# EAGLE design I2CRobot (EAGLE 5.00)
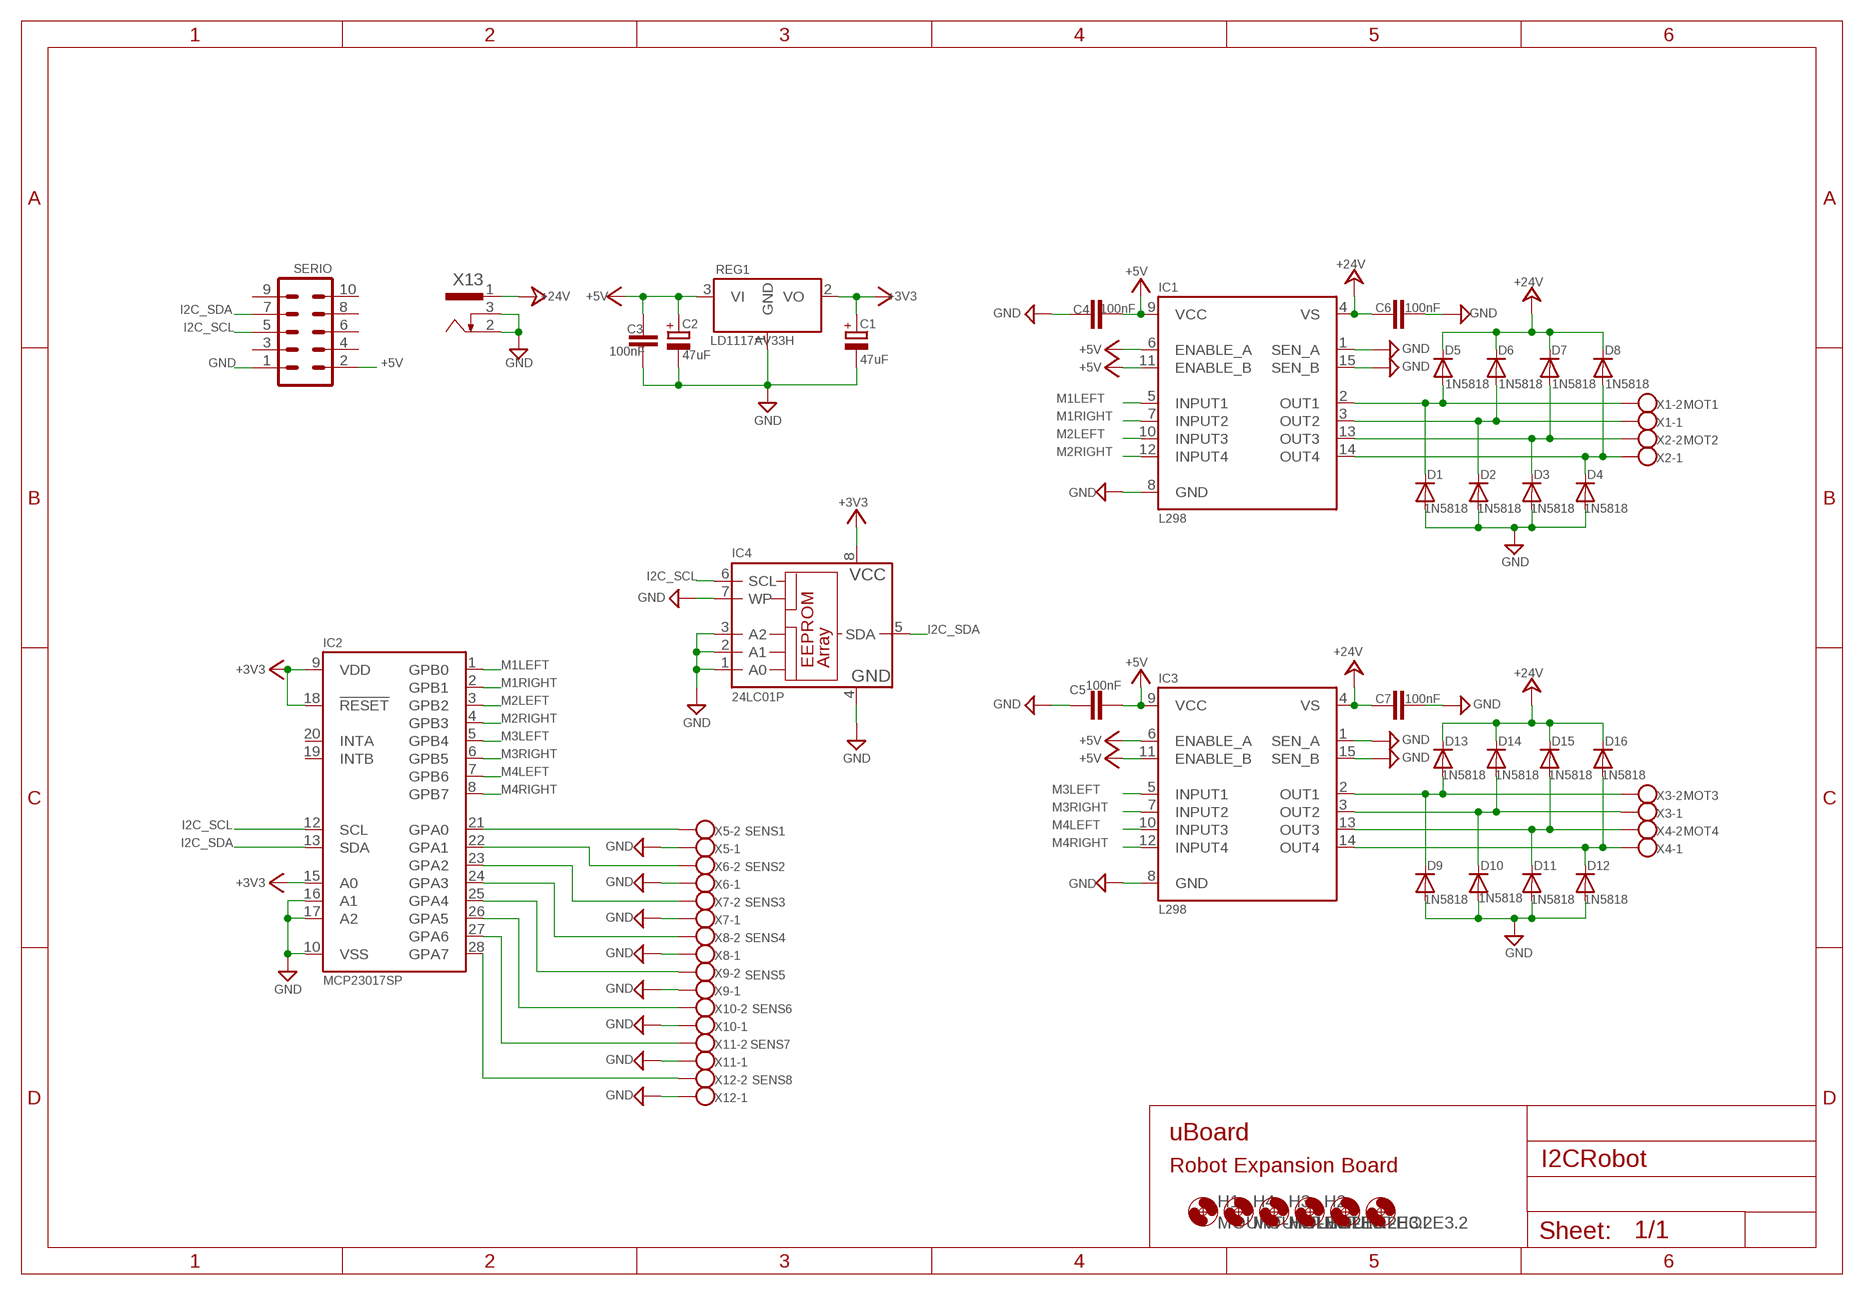
[diagram p0: schematic, sheet 1]

## Parts
C1  47uF  CPOL-EUE2,5-6E  [E2,5-6E]
C2  47uF  CPOL-EUE2,5-6E  [E2,5-6E]
C3  100nF  C-EU025-030X050  [C025-030X050]
C4  100nF  C-EU025-030X050  [C025-030X050]
C5  100nF  C-EU025-030X050  [C025-030X050]
C6  100nF  C-EU025-030X050  [C025-030X050]
C7  100nF  C-EU025-030X050  [C025-030X050]
D1  1N5818  1N4004  [DO41-10]
D2  1N5818  1N4004  [DO41-10]
D3  1N5818  1N4004  [DO41-10]
D4  1N5818  1N4004  [DO41-10]
D5  1N5818  1N4004  [DO41-10]
D6  1N5818  1N4004  [DO41-10]
D7  1N5818  1N4004  [DO41-10]
D8  1N5818  1N4004  [DO41-10]
D9  1N5818  1N4004  [DO41-10]
D10  1N5818  1N4004  [DO41-10]
D11  1N5818  1N4004  [DO41-10]
D12  1N5818  1N4004  [DO41-10]
D13  1N5818  1N4004  [DO41-10]
D14  1N5818  1N4004  [DO41-10]
D15  1N5818  1N4004  [DO41-10]
D16  1N5818  1N4004  [DO41-10]
H1  MOUNT-HOLE3.2  [3,2]
H2  MOUNT-HOLE3.2  [3,2]
H3  MOUNT-HOLE3.2  [3,2]
H4  MOUNT-HOLE3.2  [3,2]
H5  MOUNT-HOLE2.8  [2,8]
H6  MOUNT-HOLE2.8  [2,8]
IC1  L298  [MULTIWATT-15]
IC2  MCP23017SP  [DIL28-3]
IC3  L298  [MULTIWATT-15]
IC4  24LC01P  [DIL8]
REG1  LD1117AV33H  [TO220H]
SERIO  MA05-2  [MA05-2]
X1  MOT1  W237-102  [W237-102]
X2  MOT2  W237-102  [W237-102]
X3  MOT3  W237-102  [W237-102]
X4  MOT4  W237-102  [W237-102]
X5  SENS1  W237-102  [W237-102]
X6  SENS2  W237-102  [W237-102]
X7  SENS3  W237-102  [W237-102]
X8  SENS4  W237-102  [W237-102]
X9  SENS5  W237-102  [W237-102]
X10  SENS6  W237-102  [W237-102]
X11  SENS7  W237-102  [W237-102]
X12  SENS8  W237-102  [W237-102]
X13  733980-62  [733980-62]

## Nets
+3V3: C1.+ IC2.9(VDD) IC2.15(A0) IC2.18(!RESET) IC4.8(VCC) REG1.2(VO)
+5V: C2.+ C3.1 C4.2 C5.2 IC1.6(ENABLE_A) IC1.9(VCC) IC1.11(ENABLE_B) IC3.6(ENABLE_A) IC3.9(VCC) IC3.11(ENABLE_B) REG1.3(VI) SERIO.2
+24V: C6.1 C7.1 D5.C D6.C D7.C D8.C D13.C D14.C D15.C D16.C IC1.4(VS) IC3.4(VS) X13.1
GND: C1.- C2.- C3.2 C4.1 C5.1 C6.2 C7.2 D1.A D2.A D3.A D4.A D9.A D10.A D11.A D12.A IC1.1(SEN_A) IC1.8(GND) IC1.15(SEN_B) IC2.10(VSS) IC2.16(A1) IC2.17(A2) IC3.1(SEN_A) IC3.8(GND) IC3.15(SEN_B) IC4.1(A0) IC4.2(A1) IC4.3(A2) IC4.4(GND) IC4.7(WP) REG1.1(GND) SERIO.1 X5.1 X6.1 X7.1 X8.1 X9.1 X10.1 X11.1 X12.1 X13.2 X13.3
I2C_SCL: IC2.12(SCL) IC4.6(SCL) SERIO.5
I2C_SDA: IC2.13(SDA) IC4.5(SDA) SERIO.7
M1LEFT: IC1.5(INPUT1) IC2.1(GPB0)
M1RIGHT: IC1.7(INPUT2) IC2.2(GPB1)
M2LEFT: IC1.10(INPUT3) IC2.3(GPB2)
M2RIGHT: IC1.12(INPUT4) IC2.4(GPB3)
M3LEFT: IC2.5(GPB4) IC3.5(INPUT1)
M3RIGHT: IC2.6(GPB5) IC3.7(INPUT2)
M4LEFT: IC2.7(GPB6) IC3.10(INPUT3)
M4RIGHT: IC2.8(GPB7) IC3.12(INPUT4)
MOTOR1L: D1.C D5.A IC1.2(OUT1) X1.2
MOTOR1R: D2.C D6.A IC1.3(OUT2) X1.1
MOTOR2L: D3.C D7.A IC1.13(OUT3) X2.2
MOTOR2R: D4.C D8.A IC1.14(OUT4) X2.1
MOTOR3L: D9.C D13.A IC3.2(OUT1) X3.2
MOTOR3R: D10.C D14.A IC3.3(OUT2) X3.1
MOTOR4L: D11.C D15.A IC3.13(OUT3) X4.2
MOTOR4R: D12.C D16.A IC3.14(OUT4) X4.1
N$1: IC2.28(GPA7) X12.2
N$4: IC2.26(GPA5) X10.2
N$5: IC2.25(GPA4) X9.2
N$6: IC2.27(GPA6) X11.2
N$9: IC2.21(GPA0) X5.2
S1.2: IC2.22(GPA1) X6.2
S2.1: IC2.23(GPA2) X7.2
S2.2: IC2.24(GPA3) X8.2
Unconnected: IC2.19(INTB) IC2.20(INTA) SERIO.3 SERIO.4 SERIO.6 SERIO.8 SERIO.9 SERIO.10

## Notes on the sheet
- uBoard
- Robot Expansion Board

## Library data of the parts
C1 C2 = dsPIC:CPOL-EU: POLARIZED CAPACITOR, European symbol
C3-C7 = dsPIC:C-EU: CAPACITOR, European symbol
D1-D16 = diode:1N4004: DIODE general purpose rectifier, 1 A
H1-H4 = 0. workshop dsPIC:MOUNT-HOLE: MOUNTING HOLE with drill center marker
H5 H6 = dsPIC:MOUNT-HOLE: MOUNTING HOLE with drill center marker
IC1 IC3 = st-microelectronics:L298: DUAL FULL-BRIDGE DRIVER
IC2 = dsPIC:MCP23017: http://ww1.microchip.com/downloads/en/DeviceDoc/21952a.pdf Source: http://ww1.microchip.com/downloads/en/DeviceDoc/21952a.pdf
IC4 = microchip:24*: Serial EEPROM I2C
REG1 = dsPIC:LD1117AV33
SERIO = con-lstb:MA05-2: PIN HEADER
X1-X12 = con-wago-500:W237-102: WAGO SCREW CLAMP
X13 = con-conrad:73398?: FEMALE PRINT CONNECTOR Niedervolt-Steckverbinder Distributor Conrad

## Board
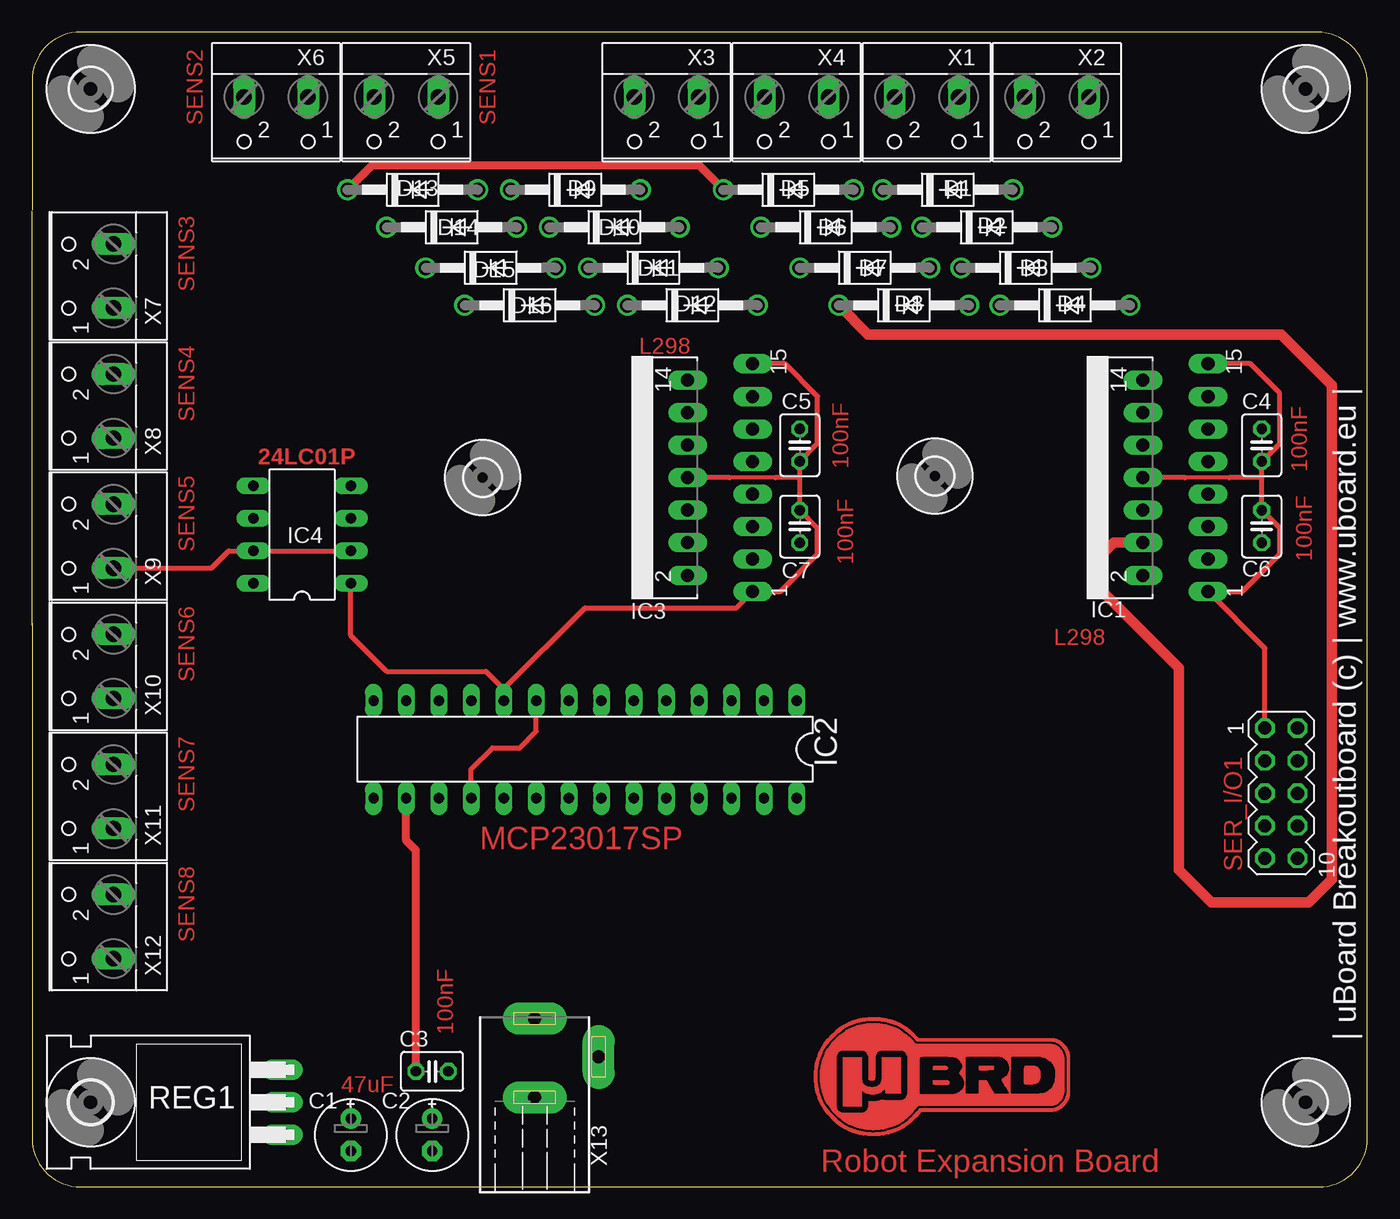
[diagram p1: board, top side]
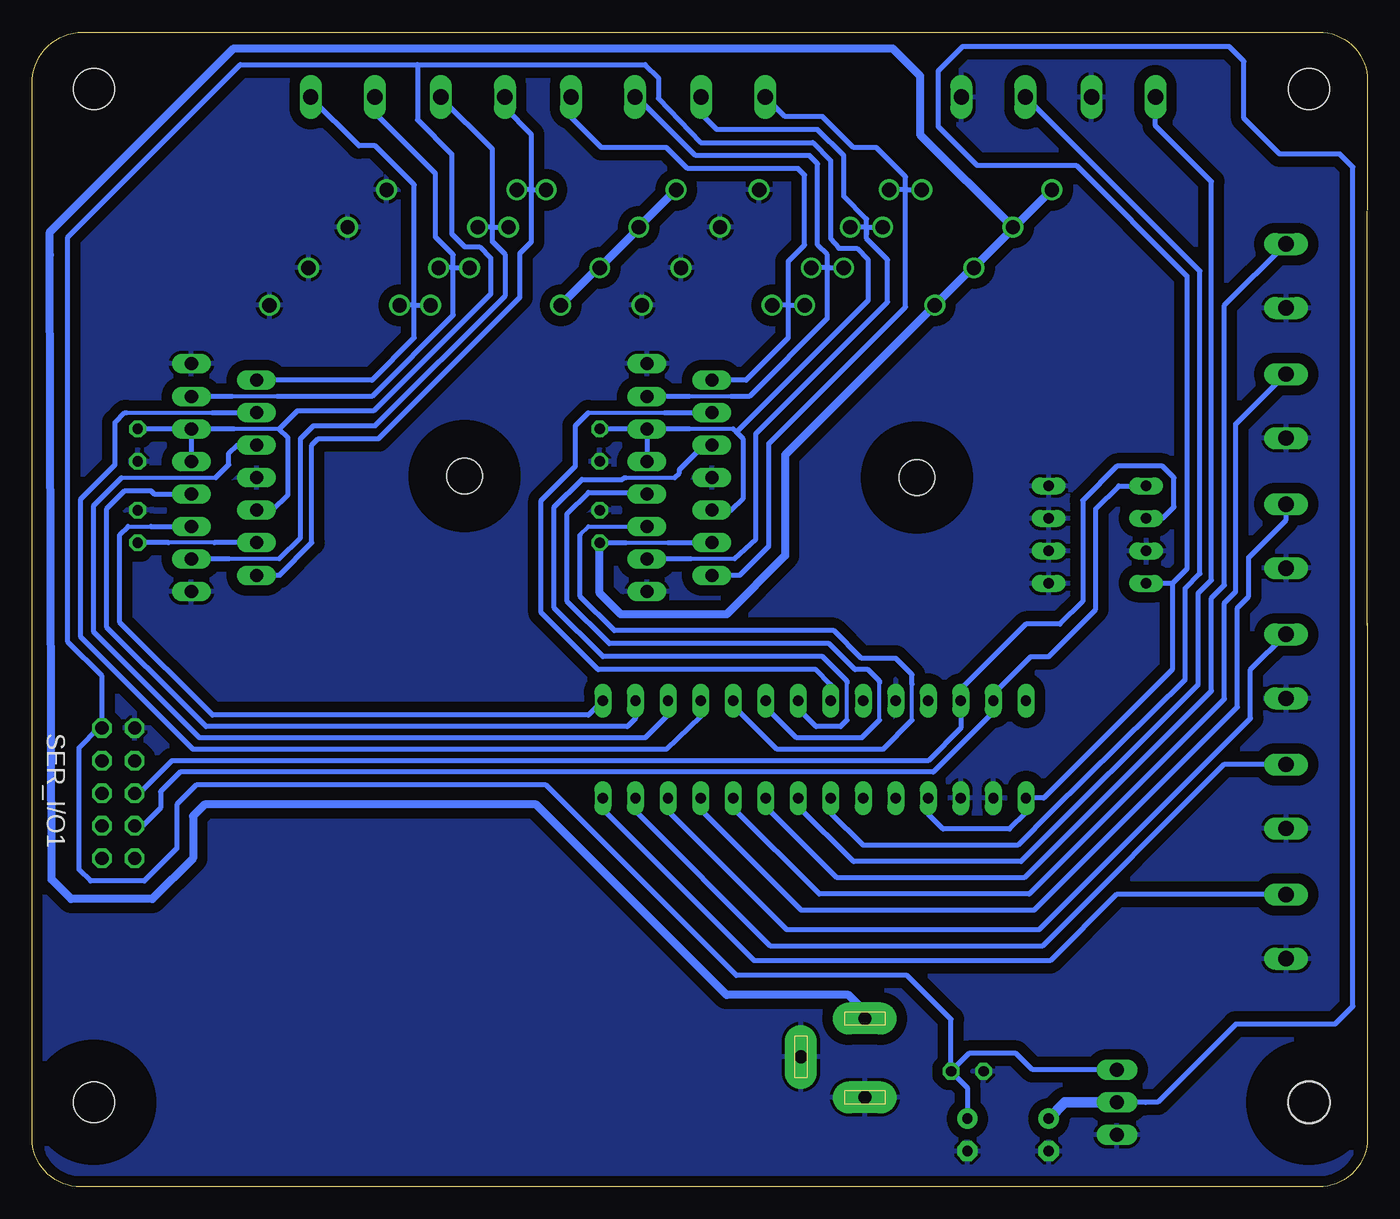
[diagram p2: board, bottom side, seen from below]

Size 104.27 x 90.17 mm. Coordinates in mm from the lower left corner, seen from the top.
Outline: 0,76.27 0,86.36 arc-90 3.81,90.17 100.33,90.17 arc-90 104.27,86.11 104.27,3.81 arc-90 100.46,0 3.81,0 arc-90 0,3.81 0,43.81
Outline: 0,44 0,43.81
Outline: 0,43.81 0,76.2
Copper layers (1*16): Top 0.035mm / dielectric 1.5mm / Bottom 0.035mm
Design rules "default *": minimum track width 10mil, minimum drill 0.6mm, track to track 16mil, track to pad 16mil, pad to pad 16mil, via to via 16mil, smd to smd 8mil, copper to edge 8mil, drill to drill 8mil, minimum pad ring 10mil, minimum via ring 8mil, stop-mask expansion 4mil, vias tented up to drill 0mil, thermal gap 10mil

### Footprints (pad centres in the part's own frame; a part is rotated, then mirrored left to right if it is on the bottom)
E2,5-6E = drill 0.8 pad 1.575 round: + -1.27,0 | drill 0.8 pad 1.575 octagon: - 1.27,0
C025-030X050 = drill 0.8 octagon: 1 -1.27,0; 2 1.27,0
DO41-10 = drill 1.118 round: A 5.08,0; C -5.08,0
3,2 = hole 3.2: 0,0
2,8 = hole 2.8: 0,0
MULTIWATT-15 = drill 1.016 long: 1 -8.89,-7.62; 2 -7.62,-2.54; 3 -6.35,-7.62; 4 -5.08,-2.54; 5 -3.81,-7.62; 6 -2.54,-2.54; 7 -1.27,-7.62; 8 0,-2.54; 9 1.27,-7.62; 10 2.54,-2.54; 11 3.81,-7.62; 12 5.08,-2.54; 13 6.35,-7.62; 14 7.62,-2.54; 15 8.89,-7.62
DIL28-3 = drill 0.813 long: 1 -16.51,-3.81; 2 -13.97,-3.81; 3 -11.43,-3.81; 4 -8.89,-3.81; 5 -6.35,-3.81; 6 -3.81,-3.81; 7 -1.27,-3.81; 8 1.27,-3.81; 9 3.81,-3.81; 10 6.35,-3.81; 11 8.89,-3.81; 12 11.43,-3.81; 13 13.97,-3.81; 14 16.51,-3.81; 15 16.51,3.81; 16 13.97,3.81; 17 11.43,3.81; 18 8.89,3.81; 19 6.35,3.81; 20 3.81,3.81; 21 1.27,3.81; 22 -1.27,3.81; 23 -3.81,3.81; 24 -6.35,3.81; 25 -8.89,3.81; 26 -11.43,3.81; 27 -13.97,3.81; 28 -16.51,3.81
DIL8 = drill 0.813 long: 1 -3.81,-3.81; 2 -1.27,-3.81; 3 1.27,-3.81; 4 3.81,-3.81; 5 3.81,3.81; 6 1.27,3.81; 7 -1.27,3.81; 8 -3.81,3.81
TO220H = drill 1.1 long: 1 -2.54,-10.16; 2 0,-10.16; 3 2.54,-10.16 | hole 3.302: 0,4.826
MA05-2 = drill 1.016 octagon: 1 -5.08,-1.27; 2 -5.08,1.27; 3 -2.54,-1.27; 4 -2.54,1.27; 5 0,-1.27; 6 0,1.27; 7 2.54,-1.27; 8 2.54,1.27; 9 5.08,-1.27; 10 5.08,1.27
W237-102 = drill 1.194 long: 1 -2.5,-1.27; 2 2.5,-1.27
733980-62 = drill 1 pad 2.5 long: 1 0,8.57; 2 0,2.42; 3 5,5.57

### Placement (x,y rotation side)
C1  24.89,4.06 270 top
C2  31.24,4.06 270 top
C3  31.24,9.02 180 top
C4  96.01,57.91 90 top
C5  59.94,57.91 90 top
C6  96.01,51.56 90 top
C7  59.94,51.56 90 top
D1  71.5,77.85 0 top
D2  74.55,74.93 0 top
D3  77.6,71.75 0 top
D4  80.64,68.83 0 top
D5  59.05,77.85 0 top
D6  61.98,74.93 0 top
D7  65.02,71.75 0 top
D8  68.07,68.83 0 top
D9  42.42,77.85 0 top
D10  45.47,74.93 0 top
D11  48.51,71.75 0 top
D12  51.56,68.83 0 top
D13  29.72,77.85 0 top
D14  32.77,74.93 0 top
D15  35.81,71.75 0 top
D16  38.86,68.83 0 top
H1  99.44,6.6 0 top
H2  4.57,6.6 0 top
H3  4.57,85.72 0 top
H4  99.44,85.72 0 top
H5  35.18,55.37 0 top
H6  70.48,55.5 0 top
IC1  84.2,55.37 90 top
IC2  43.18,34.16 180 top
IC3  48.64,55.37 90 top
IC4  21.08,50.93 90 top
REG1  9.4,6.6 90 top
SERIO  97.54,30.73 270 top
X1  69.85,83.82 180 top
X2  80.01,83.82 180 top
X3  49.53,83.82 180 top
X4  59.69,83.82 180 top
X5  29.21,83.82 180 top
X6  19.05,83.82 180 top
X7  5.08,71.12 90 top
X8  5.08,60.96 90 top
X9  5.08,50.8 90 top
X10  5.08,40.64 90 top
X11  5.08,30.48 90 top
X12  5.08,20.32 90 top
X13  39.24,4.57 0 top

### Tracks (layer width: path | path; a pad name or v marks a point on that pad's centre or on a via)
+3V3
  Top 0.406: IC2.18 34.29,32.64 35.94,34.29 38.1,34.29 39.37,35.56 IC2.9
  Bottom 0.406: 17.4,6.6 17.27,6.6 | 17.4,6.6 19.81,6.6 | IC2.18 34.29,29.08 33.15,27.94 27.94,27.94 26.67,29.21 IC2.15 | IC2.15 26.8,30.35 | 15.24,47.12 14.1,48.26 14.1,71.12 22.73,79.76 30.48,79.76 33.53,82.8 33.53,87.12 31.62,89.03 10.79,89.03 9.65,87.88 9.65,83.44 6.86,80.64 2.16,80.64 1.14,79.63 1.14,14.1 2.54,12.7 10.29,12.7 16.38,6.6 17.4,6.6 | 15.24,47.12 IC4.8 | 15.24,47.12 15.24,40.39 25.27,30.35 IC2.15
  Bottom 0.813: REG1.2 19.81,6.6 23.62,6.6 C1.+
+5V
  Bottom 0.305: 84.96,59.18 88.52,59.18 | 49.53,59.18 52.96,59.18
  Bottom 0.406: SERIO.2 98.93,35.81 | REG1.3 26.16,9.14 27.43,10.41 31.11,10.41 C3.1 | IC3.11 IC3.9 | IC1.11 IC1.9 | C2.+ 31.24,7.75 C3.1 | C3.1 32.51,13.08 35.94,16.51 49.28,16.51 64.14,31.37 91.44,31.37 92.96,29.84 92.96,26.42 95.5,23.88 99.69,23.88 100.58,24.77 100.58,34.29 99.06,35.81 SERIO.2 | IC1.11 C4.2 | SERIO.2 98.81,39.88 101.47,42.55 101.47,74.17 88.01,87.63 74.17,87.63 | 88.52,59.18 IC1.11 | IC1.6 85.47,52.83 84.33,53.98 84.33,58.55 84.96,59.18 83.57,60.58 77.6,60.58 68.45,69.72 68.45,72.52 69.34,73.41 70.48,73.41 71.5,74.42 71.5,80.64 74.17,83.31 74.17,87.63 | 52.96,59.18 IC3.11 | IC3.6 49.66,52.83 48.77,53.72 48.77,58.42 49.28,58.93 | 49.28,58.93 49.53,59.18 | IC3.11 C5.2 | 49.28,58.93 38.99,69.22 38.99,72.39 39.88,73.28 41.27,73.28 41.91,74.04 41.91,80.14 43.31,81.53 52.07,81.53 55.37,84.96 55.37,86.61 56.39,87.63 74.17,87.63
+24V
  Top 0.61: D5.C 52.07,79.76 26.54,79.76 D13.C
  Top 0.813: 85.47,50.29 85.34,50.29 | 85.47,50.29 IC1.4 | 85.47,50.29 84.45,50.29 83.57,49.4 83.57,46.48 89.53,40.51 89.53,24.77 92.08,22.23 99.69,22.23 101.47,24 101.47,62.61 97.54,66.55 65.28,66.55 D8.C
  Bottom 0.305: 57.91,50.29 54.61,50.29 | 90.04,50.29 93.6,50.29
  Bottom 0.406: D14.C 27.69,74.8 | D15.C 30.86,71.75 | D7.C 60.07,71.75 | IC1.4 90.04,50.29 | C7.1 57.91,50.29 | 51.05,50.29 IC3.4 54.61,50.29 | 93.6,50.29 C6.1
  Bottom 0.61: X13.1 39.24,13.72 40.51,14.99 50.04,14.99 64.9,29.84 90.81,29.84 91.69,28.96 91.69,25.65 94.87,22.48 101.22,22.48 102.74,24 102.87,72.77 102.87,74.55 88.52,88.9 37.08,88.9 34.92,86.74 34.92,82.17 D14.C 27.56,74.93 D13.C | 56.9,74.8 D6.C | D5.C 56.39,75.44 56.9,74.8 | 56.9,74.8 D7.C | 60.07,71.75 D8.C | 27.69,74.8 D15.C | 30.86,71.75 D16.C 45.47,57.15 45.47,49.28 50.04,44.7 58.29,44.7 59.94,46.35 C7.1
GND
  Top 0.305: 93.47,55.37 90.04,55.37 | 58.04,55.37 54.48,55.37
  Top 0.406: 25.02,49.66 IC4.2 IC4.7 15.37,49.66 14.01,48.3 X9.1 | SERIO.1 96.27,42.04 IC1.1 94.49,46.48 97.41,49.4 97.41,51.44 C6.2 96.01,55.37 | C4.1 96.01,56.77 | 96.01,55.37 C4.1 | IC1.15 95.12,64.26 97.41,61.98 97.41,58.04 C4.1 | 90.04,55.37 IC1.8 | 96.01,55.37 93.47,55.37 | 59.94,55.37 C7.2 61.34,51.44 61.34,49.4 58.42,46.48 IC3.1 54.99,45.21 43.18,45.21 36.83,38.86 | 59.94,55.37 C5.1 61.34,58.04 61.34,61.72 58.8,64.26 IC3.15 | 54.48,55.37 IC3.8 | 59.94,55.37 58.04,55.37 | IC4.1 24.89,43.05 27.69,40.26 35.43,40.26 36.83,38.86 | 36.83,38.86 IC2.10
  Top 0.61: C3.2 29.97,26.29 29.21,27.05 IC2.16
  Bottom 0.406: D9.A 47.62,77.85 | D10.A 50.55,74.8 | D1.A 76.71,77.85 | D2.A 79.63,74.8 | D3.A 82.8,71.75
  pour Bottom (isolate 0.813): 105.03,90.93 105.16,-0.76 18.03,-0.64 -0.51,-0.64 -0.76,12.95 -0.76,90.68
I2C_SCL
  Bottom 0.406: IC4.6 16,52.2 15.11,53.09 15.11,55.37 16,56.26 19.56,56.26 22.23,53.59 22.23,45.72 24,43.94 26.67,43.94 31.75,38.86 IC2.12 31.75,35.81 34.29,33.27 93.34,33.27 95.89,30.73 SERIO.5
I2C_SDA
  Bottom 0.406: IC4.5 17.65,54.74 | IC4.5 17.14,54.74 | IC4.5 19.43,54.74 21.21,52.96 21.21,45.09 24.89,41.4 26.29,41.4 29.21,38.48 IC2.13 29.21,37.08 33.91,32.38 92.71,32.38 94.23,30.86 94.23,29.59 95.63,28.19 SERIO.7
M1LEFT
  Bottom 0.305: 96.77,51.56 95,51.56
  Bottom 0.406: 91.69,51.56 IC1.5 95,51.56 | 96.77,51.56 97.41,50.93 97.41,44.07 90.17,36.83 60.83,36.83 IC2.1
M1RIGHT
  Bottom 0.406: 92.2,37.47 91.69,36.96 | 92.2,37.47 98.42,43.69 98.42,52.96 97.03,54.36 95,54.36 94.74,54.1 IC1.7 91.69,54.1 | 92.2,37.47 90.68,35.94 57.78,35.94 57.15,36.58 IC2.2
M2LEFT
  Bottom 0.305: 97.28,55.37 89.92,55.37
  Bottom 0.406: 92.2,36.07 92.08,35.94 | 92.2,36.07 99.44,43.31 99.44,53.21 97.28,55.37 | 89.92,55.37 88.9,56.39 88.9,57.28 88.27,57.91 IC1.10 86.61,57.91 | 92.2,36.07 91.19,35.05 56.39,35.05 54.61,36.83 IC2.3
M2RIGHT
  Bottom 0.305: 96.9,60.45 90.17,60.45
  Bottom 0.406: 90.17,60.45 IC1.12 | 92.58,35.05 92.46,34.92 | 92.58,35.05 100.46,42.93 100.46,53.72 97.79,56.39 97.79,59.69 97.03,60.45 96.9,60.45 | 92.58,35.05 91.69,34.16 54.74,34.16 52.07,36.7 IC2.4
M3LEFT
  Bottom 0.305: 35.56,36.45 35.56,39.24 | IC3.5 60.83,51.56 61.47,50.93
  Bottom 0.406: 35.56,36.45 37.85,34.16 46.1,34.16 49.53,37.59 IC2.5 | 35.56,39.24 35.56,40.01 36.83,41.27 39.5,41.27 41.66,43.43 58.8,43.43 61.47,46.1 61.47,50.93
M3RIGHT
  Bottom 0.305: 38.1,36.45 38.1,39.37
  Bottom 0.406: 38.1,36.45 39.5,35.05 44.58,35.05 46.99,37.47 IC2.6 | 38.1,39.37 38.1,39.5 38.99,40.39 40.01,40.39 42.04,42.42 59.18,42.42 62.48,45.72 62.48,52.58 60.83,54.23 56.52,54.23 IC3.7
M4LEFT
  Bottom 0.305: 57.91,55.37 54.1,55.37 | 40.64,36.45 40.64,39.37
  Bottom 0.406: 40.64,36.45 41.15,35.94 43.05,35.94 44.45,37.34 IC2.7 | IC3.10 51.82,57.91 53.72,56.01 53.72,55.75 54.1,55.37 | 57.91,55.37 58.04,55.37 58.17,55.24 61.34,55.24 63.5,53.09 63.5,45.21 59.69,41.4 42.55,41.4 40.64,39.5 40.64,39.37
M4RIGHT
  Bottom 0.305: 60.83,60.45 54.86,60.45
  Bottom 0.406: 54.86,60.45 IC3.12 | 60.83,60.45 61.85,59.44 61.85,56.26 64.52,53.59 64.52,44.83 60.07,40.39 43.05,40.39 41.91,39.24 IC2.8
MOTOR1L
  Bottom 0.406: 65.28,77.85 D5.A | 65.28,77.85 D1.C | 65.28,77.85 65.28,73.79 66.17,72.9 66.17,69.47 77.22,58.42 81.92,58.42 82.42,57.91 82.42,50.29 84.96,47.75 IC1.2 86.87,47.75 | 65.28,77.85 65.28,82.17 67.35,84.24 X1.2
MOTOR1R
  Bottom 0.305: 84.96,49.02 88.9,49.02
  Bottom 0.406: 68.33,74.93 D6.A | 68.33,74.93 D2.C | 68.33,74.93 68.33,73.79 67.31,72.77 67.31,69.6 77.47,59.44 82.3,59.44 83.31,58.42 83.31,50.67 84.96,49.02 | 88.9,49.02 IC1.3 | 68.33,74.93 68.33,81.03 72.35,85.05 X1.1
MOTOR2L
  Bottom 0.305: 85.09,61.72 88.65,61.72
  Bottom 0.406: 71.37,71.75 D7.A | 71.37,71.75 D3.C | 71.37,71.75 71.37,72.77 72.77,74.17 72.77,79.12 77.51,83.86 X2.2 | 88.65,61.72 IC1.13 | 85.09,61.72 77.72,61.72 71.37,68.07 71.37,71.75
MOTOR2R
  Bottom 0.406: 74.42,68.83 D8.A | 74.42,68.83 D4.C | 74.42,68.83 74.42,78.23 77.47,81.28 78.74,81.28 82.55,85.09 X2.1 | 74.42,68.83 74.42,66.29 77.72,62.99 IC1.14
MOTOR3L
  Bottom 0.406: D13.A 35.94,77.85 36.07,77.98 | D9.C 36.2,77.85 36.07,77.98 | 36.07,77.98 36.07,68.71 46.74,58.04 46.74,50.04 49.02,47.75 IC3.2 | 36.07,77.98 36.07,78.87 38.35,81.15 40.13,81.15 42.55,83.57 45.47,83.57 46.99,85.09 X3.2
MOTOR3R
  Bottom 0.305: 49.4,49.02 52.83,49.02
  Bottom 0.406: 39.12,74.93 39.12,74.42 | 39.12,74.93 D14.A | 39.12,74.93 D10.C | 39.12,74.93 39.12,74.04 37.47,72.39 37.47,69.09 47.75,58.8 47.75,50.55 49.4,49.02 | 52.83,49.02 IC3.3 | X3.1 52.03,83.78 50.8,82.55 42.93,82.55 40.89,80.52 40.89,77.34 39.12,75.56 39.12,74.93
MOTOR4L
  Bottom 0.305: 49.66,61.72 52.96,61.72
  Bottom 0.406: D15.A 42.04,71.75 42.16,71.88 | D11.C 42.29,71.75 42.16,71.88 | 52.96,61.72 IC3.13 | 42.16,71.88 42.16,67.82 48.26,61.72 49.66,61.72 | 42.16,71.88 42.16,72.77 42.93,73.53 42.93,79.88 43.56,80.52 52.45,80.52 57.02,85.09 X4.2
MOTOR4R
  Bottom 0.406: 45.21,68.83 D16.A | 45.21,68.83 D12.C | 45.21,68.83 45.21,66.29 48.51,62.99 IC3.14 | X4.1 62.19,83.53 59.82,81.15 54.74,81.15 53.09,79.5 44.45,79.5 43.94,78.99 43.94,73.53 45.21,72.26 45.21,68.83
N$1
  Bottom 0.406: IC2.28 59.69,29.46 47.88,17.65 24.77,17.65 19.6,22.82 X12.2
N$4
  Bottom 0.406: IC2.26 54.61,29.34 45.34,20.07 25.65,20.07 9.14,36.58 9.14,40.39 6.35,43.18 X10.2
N$5
  Bottom 0.406: IC2.25 52.07,29.46 44.2,21.59 26.04,21.59 10.16,37.47 10.16,45.21 9.27,46.1 9.27,49.15 6.35,52.07 X9.2
N$6
  Bottom 0.406: IC2.27 57.15,29.34 46.61,18.8 25.4,18.8 11.22,32.98 X11.2
N$9
  Bottom 0.406: IC2.21 41.91,29.21 39.37,26.67 27.3,26.67 24.64,29.34 14.22,39.62 14.22,46.74 13.08,47.88 13.08,71.5 26.67,85.09 X5.2
S1.2
  Bottom 0.406: IC2.22 44.45,29.72 40.13,25.4 27.05,25.4 13.21,39.24 13.21,46.35 12.19,47.37 12.19,78.49 16.55,82.84 X6.2
S2.1
  Bottom 0.406: 46.99,30.48 IC2.23 46.99,29.72 41.4,24.13 26.8,24.13 12.19,38.73 12.19,45.97 11.18,46.99 11.18,68.83 6.35,73.66 X7.2
S2.2
  Bottom 0.406: IC2.24 49.53,29.59 42.8,22.86 26.42,22.86 11.18,38.1 11.18,45.59 10.29,46.48 10.29,57.02 10.29,59.56 9.91,59.94 6.39,63.46 X8.2
(copper drawn outside any net)
  shapes: Top area x1325

### Text on the board
Top: SER_I/O1 | Robot Expansion Board
bPlace: SER_I/O1
tNames: | uBoard Breakoutboard (c) | www.uboard.eu |